# Altium project ANALOG.PrjPcb
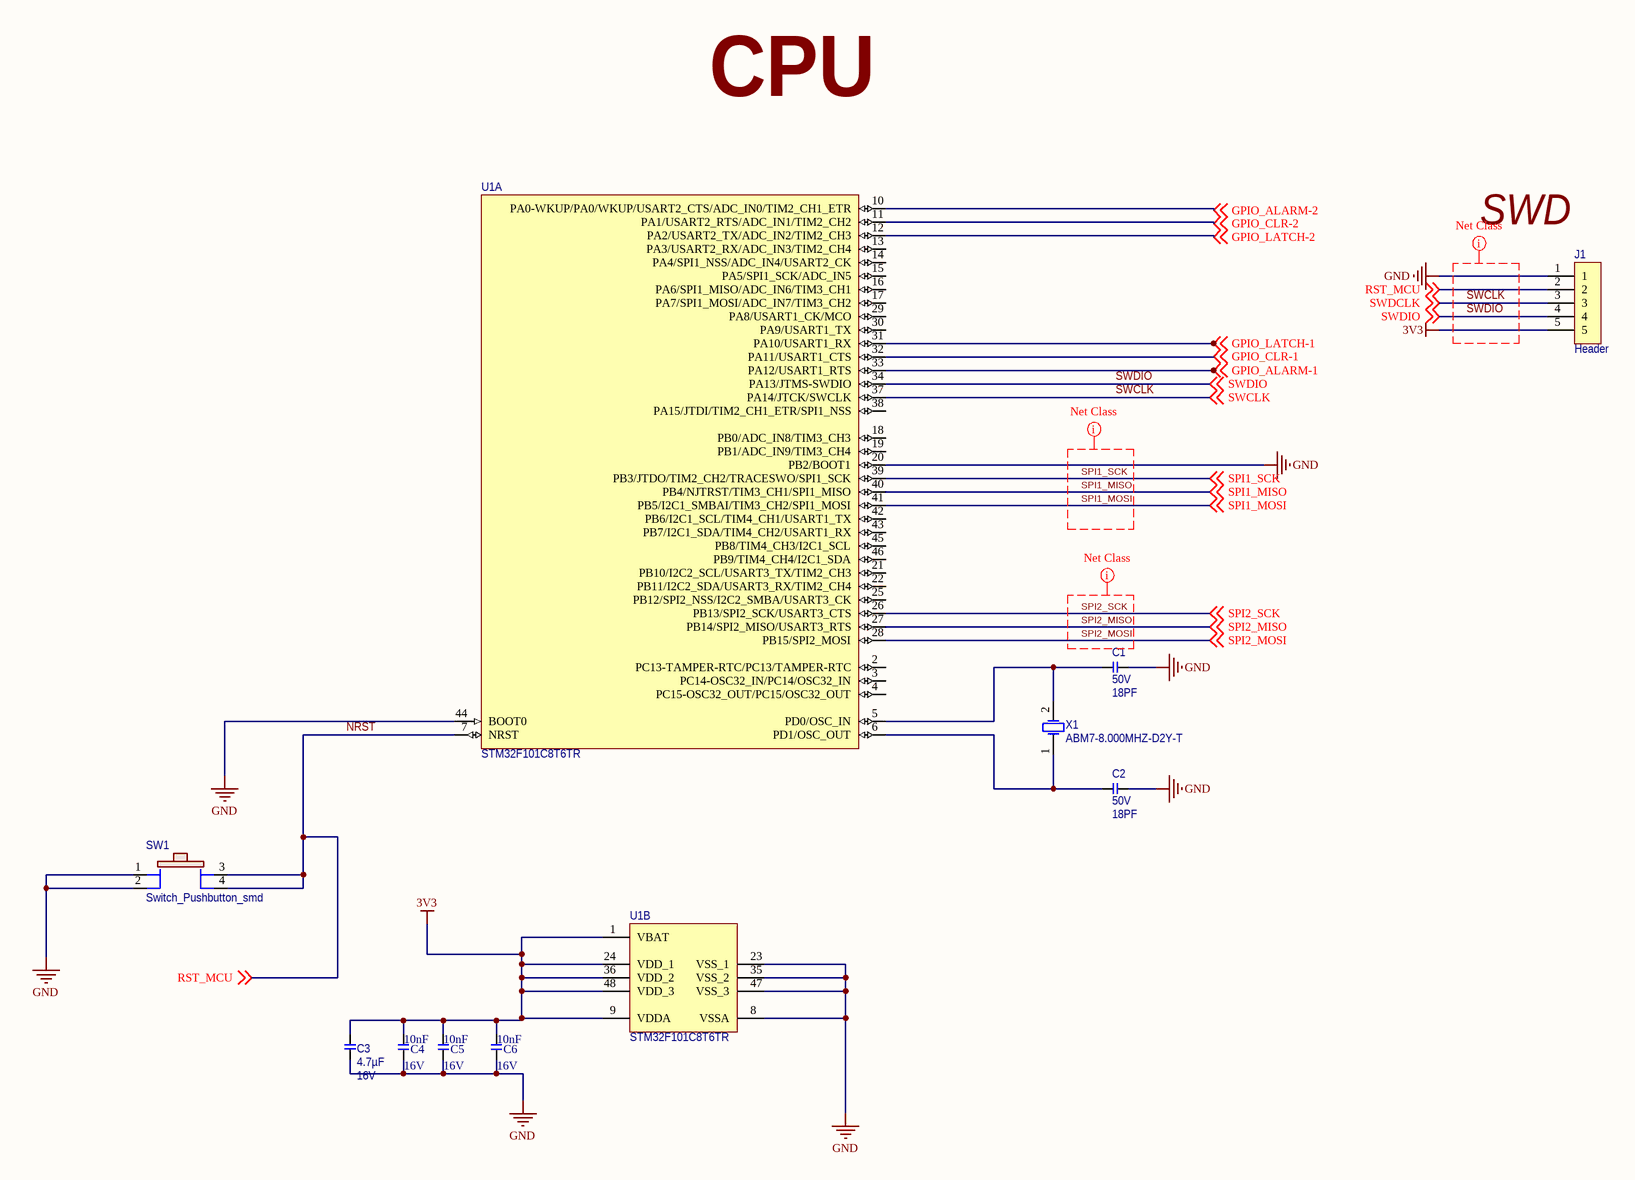
[diagram p0: [01] - STM32F101.SchDoc]
4 sheets, 83 parts. Net scope: global (net labels, ports and power ports of the same name join across sheets).
Board file: Analog_Modul.PcbDoc
Sheets:
  [01] - STM32F101.SchDoc
  [02] - AD7734.SchDoc
  [03] - DAC8760.SchDoc
  [04] - miniPCI.SchDoc

## Sheet [01] - STM32F101.SchDoc
size A3

### Parts
C1  voltage_rating_dc: 50V  [C0805]  (hidden comment: 18PF)
C2  voltage_rating_dc: 50V  [C0805]  (hidden comment: 18PF)
C3  Voltage - Rated: 16V  [C0805]  (hidden comment: 4.7µF)
C4  Voltage - Rated: 16V  [C0805]  (hidden comment: 10nF)
C5  Voltage - Rated: 16V  [C0805]  (hidden comment: 10nF)
C6  Voltage - Rated: 16V  [C0805]  (hidden comment: 10nF)
J1  Header  [Header 1x5 2.54mm]
SW1  Switch_Pushbutton_smd  [SW_B3SL-1022P]
U1  Manufacturer Part Number: STM32F101C8T6TR  [STM-LQFP48_M]  (hidden comment: IC-MC-STM32F101C8T6TR)  (parts A,B of 2)
X1  Manufacturer Part Number: ABM7-8.000MHZ-D2Y-T  [sm_osc_mixed]  (hidden comment: ABM7-8.000MHZ)

### Nets
3V3: C3.2 C4.2 C5.2 C6.2 J1.5 U1.1(VBAT) U1.9(VDDA) U1.24(VDD_1) U1.36(VDD_2) U1.48(VDD_3)
GND: C1.2 C2.2 C3.1 C4.1 C5.1 C6.1 J1.1 SW1.1 SW1.2 U1.8(VSSA) U1.20(PB2/BOOT1) U1.23(VSS_1) U1.35(VSS_2) U1.44(BOOT0) U1.47(VSS_3)
GPIO_ALARM-1: U1.33(PA12/USART1_RTS) ; off-sheet GPIO_ALARM-1  [project net ALARM-1]
GPIO_ALARM-2: U1.10(PA0-WKUP/PA0/WKUP/USART2_CTS/ADC_IN0/TIM2_CH1_ETR) ; off-sheet GPIO_ALARM-2  [project net ALARM-2]
GPIO_CLR-1: U1.32(PA11/USART1_CTS) ; off-sheet GPIO_CLR-1  [project net CLR-1]
GPIO_CLR-2: U1.11(PA1/USART2_RTS/ADC_IN1/TIM2_CH2) ; off-sheet GPIO_CLR-2  [project net CLR-2]
GPIO_LATCH-1: U1.31(PA10/USART1_RX) ; off-sheet GPIO_LATCH-1  [project net LATCH-1]
GPIO_LATCH-2: U1.12(PA2/USART2_TX/ADC_IN2/TIM2_CH3) ; off-sheet GPIO_LATCH-2  [project net LATCH-2]
NRST: J1.2 SW1.3 SW1.4 U1.7(NRST) ; off-sheet RST_MCU  [also labelled RST_MCU]
SPI1_MISO: U1.40(PB4/NJTRST/TIM3_CH1/SPI1_MISO) ; off-sheet SPI1_MISO
SPI1_MOSI: U1.41(PB5/I2C1_SMBAI/TIM3_CH2/SPI1_MOSI) ; off-sheet SPI1_MOSI
SPI1_SCK: U1.39(PB3/JTDO/TIM2_CH2/TRACESWO/SPI1_SCK) ; off-sheet SPI1_SCK
SPI2_MISO: U1.27(PB14/SPI2_MISO/USART3_RTS) ; off-sheet SPI2_MISO
SPI2_MOSI: U1.28(PB15/SPI2_MOSI) ; off-sheet SPI2_MOSI
SPI2_SCK: U1.26(PB13/SPI2_SCK/USART3_CTS) ; off-sheet SPI2_SCK
SWCLK: J1.3 U1.37(PA14/JTCK/SWCLK) ; off-sheet SWCLK, off-sheet SWDCLK  [also labelled SWDCLK]
SWDIO: J1.4 U1.34(PA13/JTMS-SWDIO) ; off-sheet SWDIO
NetC1_1: C1.1 U1.5(PD0/OSC_IN) X1.2(OSC2)
NetC2_1: C2.1 U1.6(PD1/OSC_OUT) X1.1(OSC1)

Not connected (* = marked no-connect by the designer): U1 2(PC13-TAMPER-RTC/PC13/TAMPER-RTC) 3(PC14-OSC32_IN/PC14/OSC32_IN) 4(PC15-OSC32_OUT/PC15/OSC32_OUT) 13(PA3/USART2_RX/ADC_IN3/TIM2_CH4) 14(PA4/SPI1_NSS/ADC_IN4/USART2_CK) 15(PA5/SPI1_SCK/ADC_IN5) 16(PA6/SPI1_MISO/ADC_IN6/TIM3_CH1) 17(PA7/SPI1_MOSI/ADC_IN7/TIM3_CH2) 18(PB0/ADC_IN8/TIM3_CH3) 19(PB1/ADC_IN9/TIM3_CH4) 21(PB10/I2C2_SCL/USART3_TX/TIM2_CH3) 22(PB11/I2C2_SDA/USART3_RX/TIM2_CH4) 25(PB12/SPI2_NSS/I2C2_SMBA/USART3_CK) 29(PA8/USART1_CK/MCO) 30(PA9/USART1_TX) 38(PA15/JTDI/TIM2_CH1_ETR/SPI1_NSS) 42(PB6/I2C1_SCL/TIM4_CH1/USART1_TX) 43(PB7/I2C1_SDA/TIM4_CH2/USART1_RX) 45(PB8/TIM4_CH3/I2C1_SCL) 46(PB9/TIM4_CH4/I2C1_SDA)

### Layout directives
net class SPI_1: SPI1_MISO, SPI1_MOSI, SPI1_SCK
net class SPI_2: SPI2_MISO, SPI2_MOSI, SPI2_SCK
net class SWD: SWCLK, SWDIO

### Notes on the sheet
- CPU
- (near J1) SWD

### Library data of the parts
C1 C2 = C-18PF,50V,0805: MULTICOMP - MC0805N180J500CT - CAP, MLCC, C0G/NP0, 18PF, 50V,0805, REEL; capacitance_tolerance: ±5%; pin_count: 2; Supplier 1: Octopart; Manufacturer: Multicomp; Manufacturer Part Number: MC0805N180J500CT; Stock 1: 3187; Pricing 1: 1=0.11400, 10=0.07300, 50=0.04100, 100=0.03200, 250=0.02600, 500=0.02200, 1000=0.01800 (USD); reach_svhc_compliance: No SVHC; rohs_status: Compliant; dielectric_characteristic: C0G/NP0; Octopart Url: http://octopart.com/mc0805n180j500ct-multicomp-10529169; Seller Landing  Url: https://octopart-clicks.com/click/track?country=TR&ak=8157f166&sig=03c9fd1&sid=2402&ppid=10529169&vpid=17760821&ct=offers; OctopartID: 811748bd0de05ed0; ComponentLink1URL: http://datasheet.octopart.com/MC0805N180J500CT-Multicomp-datasheet-16478625.pdf; ComponentLink1Description: http://datasheet.octopart.com/MC0805N180J500CT-Multicomp-datasheet-16478625.pdf; ComponentLink2URL: http://datasheet.octopart.com/MC0805N180J500CT-Multicomp-datasheet-22150886.pdf; ComponentLink2Description: http://datasheet.octopart.com/MC0805N180J500CT-Multicomp-datasheet-22150886.pdf; ComponentLink3URL: http://datasheet.octopart.com/MC0805N180J500CT-Multicomp-datasheet-8445804.pdf; ComponentLink3Description: http://datasheet.octopart.com/MC0805N180J500CT-Multicomp-datasheet-8445804.pdf; ComponentLink4URL: http://datasheet.octopart.com/MC0805N180J500CT-Multicomp-datasheet-34215986.pdf; ComponentLink4Description: http://datasheet.octopart.com/MC0805N180J500CT-Multicomp-datasheet-34215986.pdf; ComponentLink5URL: http://datasheet.octopart.com/MC0805N180J500CT-Multicomp-datasheet-26590290.pdf; ComponentLink5Description: http://datasheet.octopart.com/MC0805N180J500CT-Multicomp-datasheet-26590290.pdf; ComponentLink6URL: http://datasheet.octopart.com/MC0805N180J500CT-Multicomp-datasheet-15500401.pdf; ComponentLink6Description: http://datasheet.octopart.com/MC0805N180J500CT-Multicomp-datasheet-15500401.pdf; ComponentLink7URL: http://datasheet.octopart.com/MC0805N180J500CT-Multicomp-datasheet-10838970.pdf; ComponentLink7Description: http://datasheet.octopart.com/MC0805N180J500CT-Multicomp-datasheet-10838970.pdf; Supplier Part Number 1: Newark - 06R4039; capacitance: 18PF
C3 = C-4.7UF,16V,0805: AVX - 0805YC475KAT2A - CAP, MLCC, X7R, 4.7UF, 16V, 0805; Manufacturer: AVX Corporation; Tolerance: ±10%; Supplier 1: Digi-Key; Manufacturer Part Number: 0805YC475KAT2A; RoHS: RoHS Compliant; Category: Capacitors; Stock 1: 16611; Pricing 1: 1=0.78, 10=0.578, 25=0.4952, 50=0.462, 100=0.396, 250=0.363, 500=0.3135, 1000=0.264 (USD); Packaging: Cut Tape (CT); Temperature Coefficient: X7R; Mounting Type: Surface Mount, MLCC; Operating Temperature: -55°C ~ 125°C; Applications: General Purpose; Ratings: -; Package / Case: 0805 (2012 Metric); Size / Dimension: 0.079" L x 0.049" W (2.01mm x 1.25mm); Height - Seated (Max): -; Thickness (Max): 0.060" (1.52mm); Lead Spacing: -; Features: -; Lead Style: -; ComponentLink1URL: http://datasheets.avx.com/X7RDielectric.pdf; ComponentLink1Description: http://datasheets.avx.com/X7RDielectric.pdf; Supplier Part Number 1: 478-5722-1-ND; Capacitance: 4.7µF
C4-C6 = C-10NF,0805: CAP CER 10000PF 16V NP0 0805; Manufacturer: AVX Corporation; Manufacturer Part Number: 0805YA103JAT2A; Tolerance: ±5%; Temperature Coefficient: C0G, NP0; Supplier 1: Digi-Key; RoHS: RoHS Compliant; Category: Capacitors; Stock 1: 28062; Pricing 1: 1=0.29, 10=0.204, 25=0.1668, 50=0.1424, 100=0.1221, 250=0.10176, 500=0.09158, 1000=0.07733 (USD); Packaging: Cut Tape (CT); Mounting Type: Surface Mount, MLCC; Operating Temperature: -55°C ~ 125°C; Applications: General Purpose; Ratings: -; Package / Case: 0805 (2012 Metric); Size / Dimension: 0.079" L x 0.049" W (2.01mm x 1.25mm); Height - Seated (Max): -; Thickness (Max): 0.037" (0.94mm); Lead Spacing: -; Features: -; Lead Style: -; ComponentLink1URL: http://datasheets.avx.com/C0GNP0-Dielectric.pdf; ComponentLink1Description: http://datasheets.avx.com/C0GNP0-Dielectric.pdf; Supplier Part Number 1: 478-1334-1-ND; Capacitance: 10nF
J1 = CON-Header 1X5 2.54MM: Header 1X5 2.54
SW1 = Switch_Pushbutton_smd: Switch Push Button tactile; TIIntPartnumber: 2W0018; MfrNum: B3SL-1022P; Mfr: Omron; PartName: SwitchPushMomTactilesmd; Cost10K: 0.25; Cost100: 0.340; Vendor: Digikey; DescriptiveText: Switch Push Button tactile; Descriptive_Text: Switch Push Button tactile
U1 = IC-MC-STM32F101C8T6TR: IC MCU 32BIT 64KB FLASH 48LQFP; Manufacturer: STMicroelectronics; Core Processor: ARM® Cortex®-M3; Core Size: 32-Bit; Speed: 36MHz; Connectivity: I²C, IrDA, LIN, SPI, UART/USART; Peripherals: DMA, PDR, POR, PVD, PWM, Temp Sensor, WDT; Number of I/O: 37; Program Memory Size: 64KB (64K x 8); RAM Size: 10K x 8; Voltage - Supply (Vcc/Vdd): 2 V ~ 3.6 V; Data Converters: A/D 10x12b; Oscillator Type: Internal; Supplier 1: Digi-Key; RoHS: RoHS Compliant; Category: Integrated Circuits (ICs); Stock 1: 0; Pricing 1: 2400=2.46449 (USD); Packaging: Tape & Reel (TR); Program Memory Type: FLASH; EEPROM Size: -; Operating Temperature: -40°C ~ 85°C (TA); Package / Case: 48-LQFP; Supplier Device Package: 48-LQFP (7x7); ComponentLink1URL: http://www.st.com/content/ccc/resource/technical/document/datasheet/6b/28/4e/ce/a7/d3/42/8d/CD00161561.pdf/files/CD00161561.pdf/jcr:content/translations/en.CD00161561.pdf; ComponentLink1Description: http://www.st.com/content/ccc/resource/technical/document/datasheet/6b/28/4e/ce/a7/d3/42/8d/CD00161561.pdf/files/CD00161561.pdf/jcr:content/translations/en.CD00161561.pdf; Supplier Part Number 1: STM32F101C8T6TR-ND
X1 = OSC-ABM7-8.000MHZ-D2Y-T: CRYSTAL 8.0000MHZ 18PF SMD; Manufacturer: Abracon LLC; Frequency: 8MHz; Frequency Stability: ±30ppm; Frequency Tolerance: ±20ppm; ESR (Equivalent Series Resistance): 100 Ohm; Operating Mode: Fundamental; Supplier 1: Digi-Key; RoHS: RoHS Compliant; Category: Crystals and Oscillators; Stock 1: 111842; Pricing 1: 1=0.76, 10=0.678, 50=0.6328, 100=0.56, 500=0.5292 (USD); Packaging: Cut Tape (CT); Type: MHz Crystal; Load Capacitance: 18pF; Operating Temperature: -40°C ~ 85°C; Ratings: -; Mounting Type: Surface Mount; Package / Case: 2-SMD, No Lead (DFN, LCC); Size / Dimension: 0.236" L x 0.138" W (6.00mm x 3.50mm); Height: 0.055" (1.40mm); ComponentLink1URL: http://www.abracon.com/Resonators/abm7.pdf; ComponentLink1Description: http://www.abracon.com/Resonators/abm7.pdf; Supplier Part Number 1: 535-9831-1-ND

## Sheet [02] - AD7734.SchDoc
size A3
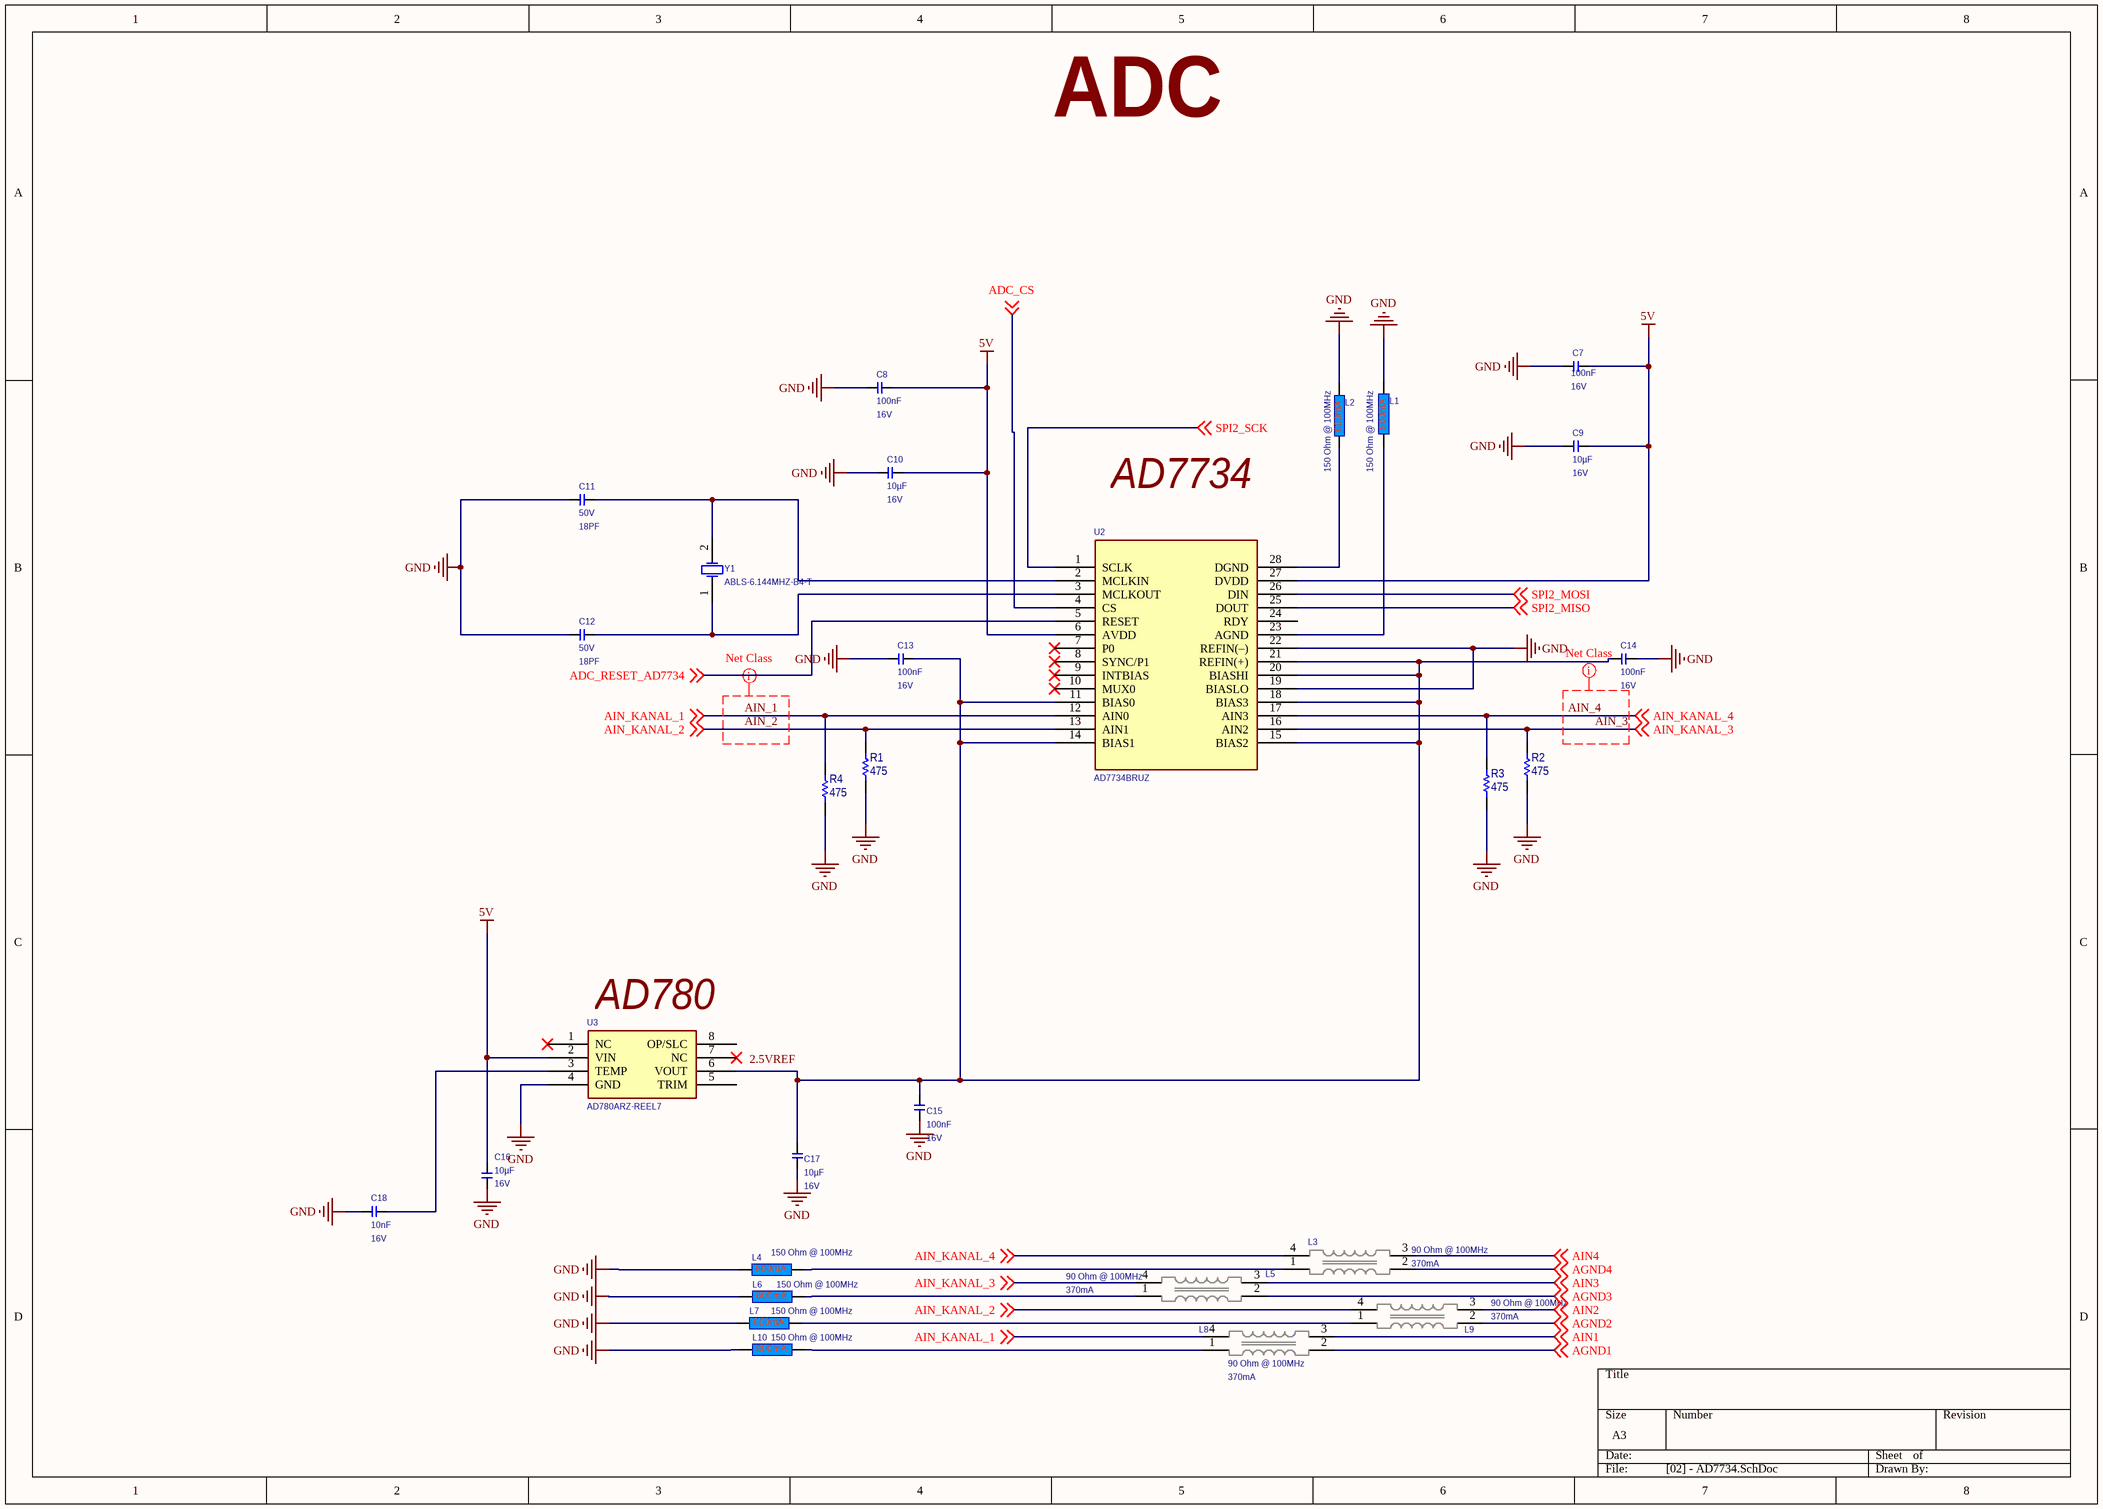
[diagram p1: [02] - AD7734.SchDoc]

### Parts
C7  Voltage - Rated: 16V  [C0805]  (hidden comment: 100nF)
C8  Voltage - Rated: 16V  [C0805]  (hidden comment: 100nF)
C9  Voltage - Rated: 16V  [C0805]  (hidden comment: 10µF)
C10  Voltage - Rated: 16V  [C0805]  (hidden comment: 10µF)
C11  voltage_rating_dc: 50V  [C0805]  (hidden comment: 18PF)
C12  voltage_rating_dc: 50V  [C0805]  (hidden comment: 18PF)
C13  Voltage - Rated: 16V  [C0805]  (hidden comment: 100nF)
C14  Voltage - Rated: 16V  [C0805]  (hidden comment: 100nF)
C15  Voltage - Rated: 16V  [C0805]  (hidden comment: 100nF)
C16  Voltage - Rated: 16V  [C0805]  (hidden comment: 10µF)
C17  Voltage - Rated: 16V  [C0805]  (hidden comment: 10µF)
C18  Voltage - Rated: 16V  [C0805]  (hidden comment: 10nF)
L1  150 Ohm @ 100MHz  [0805]
L2  150 Ohm @ 100MHz  [0805]
L3  Current Rating (Max): 370mA  [FILTER]  (hidden comment: 90 Ohm @ 100MHz)
L4  150 Ohm @ 100MHz  [0805]
L5  Current Rating (Max): 370mA  [FILTER]  (hidden comment: 90 Ohm @ 100MHz)
L6  150 Ohm @ 100MHz  [0805]
L7  150 Ohm @ 100MHz  [0805]
L8  Current Rating (Max): 370mA  [FILTER]  (hidden comment: 90 Ohm @ 100MHz)
L9  Current Rating (Max): 370mA  [FILTER]  (hidden comment: 90 Ohm @ 100MHz)
L10  150 Ohm @ 100MHz  [0805]
R1  Resistance (Ohms): 475  [R1206]  (hidden comment: RES SMD 475 OHM 1206)
R2  Resistance (Ohms): 475  [R1206]  (hidden comment: RES SMD 475 OHM 1206)
R3  Resistance (Ohms): 475  [R1206]  (hidden comment: RES SMD 475 OHM 1206)
R4  Resistance (Ohms): 475  [R1206]  (hidden comment: RES SMD 475 OHM 1206)
U2  AD7734BRUZ  [TSSOP-28]
U3  Manufacturer Part Number: AD780ARZ-REEL7  [SOIC-8]  (hidden comment: AD780ARZ)
Y1  Manufacturer Part Number: ABLS-6.144MHZ-B4-T  [HEADER,2PİN ADC]  (hidden comment: ABLS-6.144MHZ)

### Nets
5V: C7.2 C8.2 C9.2 C10.2 C16.2 U2.6(AVDD) U2.27(DVDD) U3.2(VIN)
GND: C7.1 C8.1 C9.1 C10.1 C11.1 C12.1 C13.1 C14.2 C15.2 C16.1 C17.1 C18.1 L1.2 L2.2 L4.1 L6.1 L7.1 L10.1 R1.1 R2.1 R3.1 R4.1 U2.19(BIASLO) U2.22(REFIN(–)) U3.4(GND)
ADC_CS: U2.4(CS) ; off-sheet ADC_CS
ADC_RESET_AD7734: U2.5(RESET) ; off-sheet ADC_RESET_AD7734
AGND1: L8.2 ; off-sheet AGND1
AGND2: L9.2 ; off-sheet AGND2
AGND3: L5.2 ; off-sheet AGND3
AGND4: L3.2 ; off-sheet AGND4
AIN1: L8.3 ; off-sheet AIN1
AIN2: L9.3 ; off-sheet AIN2
AIN3: L5.3 ; off-sheet AIN3
AIN4: L3.3 ; off-sheet AIN4
AIN_1: L8.4 R4.2 U2.12(AIN0) ; off-sheet AIN_KANAL_1  [also labelled AIN_KANAL_1]
AIN_2: L9.4 R1.2 U2.13(AIN1) ; off-sheet AIN_KANAL_2  [also labelled AIN_KANAL_2]
AIN_3: L5.4 R2.2 U2.16(AIN2) ; off-sheet AIN_KANAL_3  [also labelled AIN_KANAL_3]
AIN_4: L3.4 R3.2 U2.17(AIN3) ; off-sheet AIN_KANAL_4  [also labelled AIN_KANAL_4]
SPI2_MISO: U2.25(DOUT) ; off-sheet SPI2_MISO
SPI2_MOSI: U2.26(DIN) ; off-sheet SPI2_MOSI
SPI2_SCK: U2.1(SCLK) ; off-sheet SPI2_SCK
NetC11_2: C11.2 U2.2(MCLKIN) Y1.2(OSC2)
NetC12_2: C12.2 U2.3(MCLKOUT) Y1.1(OSC1)
NetC13_2: C13.2 C14.1 C15.1 C17.2 U2.11(BIAS0) U2.14(BIAS1) U2.15(BIAS2) U2.18(BIAS3) U2.20(BIASHI) U2.21(REFIN(+)) U3.6(VOUT)
NetC18_2: C18.2 U3.3(TEMP)
NetL1_1: L1.1 U2.23(AGND)
NetL2_1: L2.1 U2.28(DGND)
NetL3_1: L3.1 L4.2
NetL5_1: L5.1 L6.2
NetL7_2: L7.2 L9.1
NetL8_1: L8.1 L10.2

Not connected (* = marked no-connect by the designer): U2 7(P0)* 8(SYNC/P1)* 9(INTBIAS)* 10(MUX0)* 24(RDY); U3 1(NC)* 5(TRIM) 7(NC)* 8(OP/SLC)

### Layout directives
net class ADC_IN: AIN_1, AIN_2, AIN_3, AIN_4

### Notes on the sheet
- ADC
- AD7734
- (near U3) AD780
- Labels drawn without touching a wire or pin: 2.5VREF

### Library data of the parts
C7 C8 C13-C15 = C-100NF,16V,0805: AVX - 0805YA103JAT2A - CAP, MLCC, C0G/NP0, 10NF, 16V, 0805; Tolerance: ±5%; Temperature Coefficient: C0G, NP0; Manufacturer: AVX; Manufacturer Part Number: 0805YA103JAT2A; RoHS: YES; ComponentLink1URL: http://www.avx.com/docs/Catalogs/ccog.pdf; ComponentLink1Description: http://www.avx.com/docs/Catalogs/ccog.pdf; ComponentLink2URL: http://www.farnell.com/datasheets/1825494.pdf; ComponentLink2Description: http://www.farnell.com/datasheets/1825494.pdf; Supplier 1: Digi-Key; Category: Capacitors; Stock 1: 28062; Pricing 1: 1=0.29, 10=0.204, 25=0.1668, 50=0.1424, 100=0.1221, 250=0.10176, 500=0.09158, 1000=0.07733 (USD); Packaging: Cut Tape (CT); Mounting Type: Surface Mount, MLCC; Operating Temperature: -55°C ~ 125°C; Applications: General Purpose; Ratings: -; Package / Case: 0805 (2012 Metric); Size / Dimension: 0.079" L x 0.049" W (2.01mm x 1.25mm); Height - Seated (Max): -; Thickness (Max): 0.037" (0.94mm); Lead Spacing: -; Features: -; Lead Style: -; ComponentLink3URL: http://datasheets.avx.com/C0GNP0-Dielectric.pdf; ComponentLink3Description: http://datasheets.avx.com/C0GNP0-Dielectric.pdf; Supplier Part Number 1: 478-1334-1-ND; Capacitance: 100nF
C9 C10 C16 C17 = C-10UF,16V,0805: AVX - 0805YD106KAT2A - CAP, MLCC, X5R, 10UF, 16V, 0805; Manufacturer: AVX Corporation; Tolerance: ±10%; Supplier 1: Digi-Key; Manufacturer Part Number: 0805YD106KAT2A; RoHS: RoHS Compliant; Category: Capacitors; Stock 1: 293738; Pricing 1: 1=0.18, 10=0.124, 25=0.0908, 50=0.0742, 100=0.0627, 250=0.05116, 500=0.0429, 1000=0.03795 (USD); Packaging: Digi-Reel®; Temperature Coefficient: X5R; Mounting Type: Surface Mount, MLCC; Operating Temperature: -55°C ~ 85°C; Applications: General Purpose; Ratings: -; Package / Case: 0805 (2012 Metric); Size / Dimension: 0.079" L x 0.049" W (2.01mm x 1.25mm); Height - Seated (Max): -; Thickness (Max): 0.055" (1.40mm); Lead Spacing: -; Features: -; Lead Style: -; ComponentLink1URL: http://datasheets.avx.com/cx5r.pdf; ComponentLink1Description: http://datasheets.avx.com/cx5r.pdf; Supplier Part Number 1: 478-5165-6-ND; Capacitance: 10µF
C11 C12 = C-18PF,50V,0805: as C1 on sheet [01] - STM32F101; Supplier 1: Octopart; Manufacturer: Multicomp; Manufacturer Part Number: MC0805N180J500CT; Stock 1: 3187; Pricing 1: 1=0.11400, 10=0.07300, 50=0.04100, 100=0.03200, 250=0.02600, 500=0.02200, 1000=0.01800 (USD); reach_svhc_compliance: No SVHC; rohs_status: Compliant; dielectric_characteristic: C0G/NP0; Octopart Url: http://octopart.com/mc0805n180j500ct-multicomp-10529169; Seller Landing  Url: https://octopart-clicks.com/click/track?country=TR&ak=8157f166&sig=03c9fd1&sid=2402&ppid=10529169&vpid=17760821&ct=offers; OctopartID: 811748bd0de05ed0; ComponentLink1URL: http://datasheet.octopart.com/MC0805N180J500CT-Multicomp-datasheet-16478625.pdf; ComponentLink1Description: http://datasheet.octopart.com/MC0805N180J500CT-Multicomp-datasheet-16478625.pdf; ComponentLink2URL: http://datasheet.octopart.com/MC0805N180J500CT-Multicomp-datasheet-22150886.pdf; ComponentLink2Description: http://datasheet.octopart.com/MC0805N180J500CT-Multicomp-datasheet-22150886.pdf; ComponentLink3URL: http://datasheet.octopart.com/MC0805N180J500CT-Multicomp-datasheet-8445804.pdf; ComponentLink3Description: http://datasheet.octopart.com/MC0805N180J500CT-Multicomp-datasheet-8445804.pdf; ComponentLink4URL: http://datasheet.octopart.com/MC0805N180J500CT-Multicomp-datasheet-34215986.pdf; ComponentLink4Description: http://datasheet.octopart.com/MC0805N180J500CT-Multicomp-datasheet-34215986.pdf; ComponentLink5URL: http://datasheet.octopart.com/MC0805N180J500CT-Multicomp-datasheet-26590290.pdf; ComponentLink5Description: http://datasheet.octopart.com/MC0805N180J500CT-Multicomp-datasheet-26590290.pdf; ComponentLink6URL: http://datasheet.octopart.com/MC0805N180J500CT-Multicomp-datasheet-15500401.pdf; ComponentLink6Description: http://datasheet.octopart.com/MC0805N180J500CT-Multicomp-datasheet-15500401.pdf; ComponentLink7URL: http://datasheet.octopart.com/MC0805N180J500CT-Multicomp-datasheet-10838970.pdf; ComponentLink7Description: http://datasheet.octopart.com/MC0805N180J500CT-Multicomp-datasheet-10838970.pdf; Supplier Part Number 1: Newark - 06R4039; capacitance: 18PF
C18 = C-10NF,0805: as C4 on sheet [01] - STM32F101; Supplier 1: Digi-Key; RoHS: RoHS Compliant; Category: Capacitors; Stock 1: 28062; Pricing 1: 1=0.29, 10=0.204, 25=0.1668, 50=0.1424, 100=0.1221, 250=0.10176, 500=0.09158, 1000=0.07733 (USD); Packaging: Cut Tape (CT); Mounting Type: Surface Mount, MLCC; Operating Temperature: -55°C ~ 125°C; Applications: General Purpose; Ratings: -; Package / Case: 0805 (2012 Metric); Size / Dimension: 0.079" L x 0.049" W (2.01mm x 1.25mm); Height - Seated (Max): -; Thickness (Max): 0.037" (0.94mm); Lead Spacing: -; Features: -; Lead Style: -; ComponentLink1URL: http://datasheets.avx.com/C0GNP0-Dielectric.pdf; ComponentLink1Description: http://datasheets.avx.com/C0GNP0-Dielectric.pdf; Supplier Part Number 1: 478-1334-1-ND; Capacitance: 10nF
L1 L2 L4 L6 L7 L10 = L-150OHM,800MA: FERRITE 800MA 150 OHM 0805 SMD; Manufacturer: Laird-Signal Integrity Products; Manufacturer Part Number: LI0805H151R-10; DC Resistance (DCR): 150 mOhm Max; Filter Type: Differential Mode - Single; Supplier 1: Digi-Key; RoHS: RoHS Compliant; Category: Filters; Stock 1: 418596; Pricing 1: 1=0.1, 10=0.07, 25=0.064, 50=0.0574, 100=0.0421, 250=0.03064, 500=0.02808, 1000=0.02424 (USD); Packaging: Cut Tape (CT); Current Rating: 800mA; Package / Case: 0805 (2012 Metric); Mounting Type: Surface Mount; Height (Max): 0.043" (1.10mm); Size / Dimension: 0.079" L x 0.049" W (2.00mm x 1.25mm); ComponentLink1URL: http://www.lairdtech.com/WorkArea/linkit.aspx?LinkIdentifier=id&ItemID=4912; ComponentLink1Description: http://www.lairdtech.com/WorkArea/linkit.aspx?LinkIdentifier=id&ItemID=4912; Supplier Part Number 1: 240-2384-1-ND; Impedance @ Frequency: 150 Ohm @ 100MHz
L3 L5 L8 L9 = L-CMC 90 OHM 370MA 2 LN SMD: CMC 90 OHM 370MA 2 LN SMD; Manufacturer: Abracon LLC; Manufacturer Part Number: ACM-31-900M-T; Filter Type: Signal Line; Number of Lines: 2; DC Resistance (DCR) (Max): 300 mOhm; Voltage Rating - DC: 50V; Supplier 1: Digi-Key; RoHS: RoHS Compliant; Category: Filters; Stock 1: 3796; Pricing 1: 1=0.5, 10=0.44, 25=0.4124, 50=0.3576, 100=0.33, 250=0.31352, 500=0.286, 1000=0.242 (USD); Packaging: Cut Tape (CT); Inductance @ Frequency: -; Voltage Rating - AC: -; Operating Temperature: -40°C ~ 85°C; Ratings: -; Approvals: -; Features: -; Mounting Type: Surface Mount; Size / Dimension: 0.118" L x 0.063" W (3.00mm x 1.60mm); Height (Max): 0.079" (2.00mm); Package / Case: Horizontal, 4 PC Pad; ComponentLink1URL: http://www.abracon.com/Magnetics/chokes/ACM-31.pdf; ComponentLink1Description: http://www.abracon.com/Magnetics/chokes/ACM-31.pdf; Supplier Part Number 1: 535-12752-1-ND; Impedance @ Frequency: 90 Ohm @ 100MHz
R1-R4 = R-475R,1206: RES SMD 475 OHM 1% 1/2W 1206; Manufacturer: Stackpole Electronics Inc.; Manufacturer Part Number: RNCP1206FTD475R; Power (Watts): 0.5W, 1/2W; Temperature Coefficient: ±100ppm/°C; Supplier 1: Digi-Key; RoHS: RoHS Compliant; Category: Resistors; Stock 1: 673911; Pricing 1: 1=0.1, 10=0.049, 50=0.0272, 100=0.0201, 250=0.01536, 500=0.01228, 1000=0.00904, 2500=0.00784 (USD); Packaging: Cut Tape (CT); Part Status: Active; Tolerance: ±1%; Composition: Thin Film; Features: Anti-Sulfur, Moisture Resistant; Operating Temperature: -55°C ~ 155°C; Package / Case: 1206 (3216 Metric); Supplier Device Package: 1206; Size / Dimension: 0.122" L x 0.059" W (3.10mm x 1.50mm); Height: 0.024" (0.60mm); Number of Terminations: 2; Failure Rate: -; ComponentLink1URL: http://www.seielect.com/catalog/SEI-RNCP.pdf; ComponentLink1Description: http://www.seielect.com/catalog/SEI-RNCP.pdf; Supplier Part Number 1: RNCP1206FTD475RCT-ND
U2 = IC-AD7734BRUZ: IC ADC 24BIT 4-CH 28-TSSOP; Manufacturer: Analog Devices Inc.; Number of Bits: 24; Sampling Rate (Per Second): 15.4k; Number of Inputs: 4; Input Type: Single Ended; Data Interface: SPI, DSP; Configuration: MUX-ADC; Number of A/D Converters: 1; Architecture: Sigma-Delta; Reference Type: External; Voltage - Supply, Analog: 5V; Voltage - Supply, Digital: 2.7 V ~ 3.6 V, 5V; Supplier 1: Digi-Key; RoHS: RoHS Compliant; Category: Integrated Circuits (ICs); Stock 1: 383; Pricing 1: 1=20.47, 10=18.882, 100=16.1242, 500=14.63904, 1000=13.7904, 2500=13.36608, 5000=13.056 (USD); Packaging: Tube; Ratio - S/H:ADC: -; Features: True Bipolar; Operating Temperature: -40°C ~ 105°C; Package / Case: 28-TSSOP (0.173", 4.40mm Width); Supplier Device Package: 28-TSSOP; ComponentLink1URL: http://www.analog.com/media/en/technical-documentation/data-sheets/AD7734.pdf; ComponentLink1Description: http://www.analog.com/media/en/technical-documentation/data-sheets/AD7734.pdf; Supplier Part Number 1: AD7734BRUZ-ND; Manufacturer Part Number: AD7734BRUZ
U3 = IC-AD780ARZ: IC VREF SERIES/SHUNT PROG 8SOIC; Manufacturer: Analog Devices Inc.; Reference Type: Series, Shunt; Output Type: Programmable; Voltage - Output (Min/Fixed): ±2.5V, ±3V; Current - Output: 10mA; Tolerance: ±0.2%, ±0.17%; Temperature Coefficient: 7ppm/°C; Noise - 0.1Hz to 10Hz: 4µVp-p; Voltage - Input: 4 V ~ 36 V; Current - Supply: 1mA; Supplier 1: Digi-Key; RoHS: RoHS Compliant; Category: Integrated Circuits (ICs); Stock 1: 1014; Pricing 1: 1=10.53, 10=9.545, 100=7.8685, 500=6.8796 (USD); Packaging: Cut Tape (CT); Voltage - Output (Max): -; Noise - 10Hz to 10kHz: -; Current - Cathode: 1mA; Operating Temperature: -40°C ~ 85°C (TA); Mounting Type: Surface Mount; Package / Case: 8-SOIC (0.154", 3.90mm Width); Supplier Device Package: 8-SOIC; ComponentLink1URL: http://www.analog.com/media/en/technical-documentation/data-sheets/AD780.pdf; ComponentLink1Description: http://www.analog.com/media/en/technical-documentation/data-sheets/AD780.pdf; Supplier Part Number 1: AD780ARZ-REEL7CT-ND
Y1 = OSC-ABLS-6.144MHZ-B4-T: CRYSTAL 6.1440MHZ 18PF SMD; Manufacturer: Abracon LLC; Frequency Stability: ±50ppm; Frequency Tolerance: ±30ppm; ESR (Equivalent Series Resistance): 100 Ohm; Operating Mode: Fundamental; Supplier 1: Digi-Key; RoHS: RoHS Compliant; Category: Crystals and Oscillators; Stock 1: 3930; Pricing 1: 1=0.35, 10=0.289, 50=0.2596, 100=0.231, 500=0.22 (USD); Packaging: Cut Tape (CT); Type: MHz Crystal; Frequency: 6.144MHz; Load Capacitance: 18pF; Operating Temperature: -20°C ~ 70°C; Ratings: -; Mounting Type: Surface Mount; Package / Case: HC49/US; Size / Dimension: 0.449" L x 0.185" W (11.40mm x 4.70mm); Height: 0.165" (4.20mm); ComponentLink1URL: http://www.abracon.com/Resonators/abls.pdf; ComponentLink1Description: http://www.abracon.com/Resonators/abls.pdf; Supplier Part Number 1: 535-10209-1-ND

## Sheet [03] - DAC8760.SchDoc
size A2
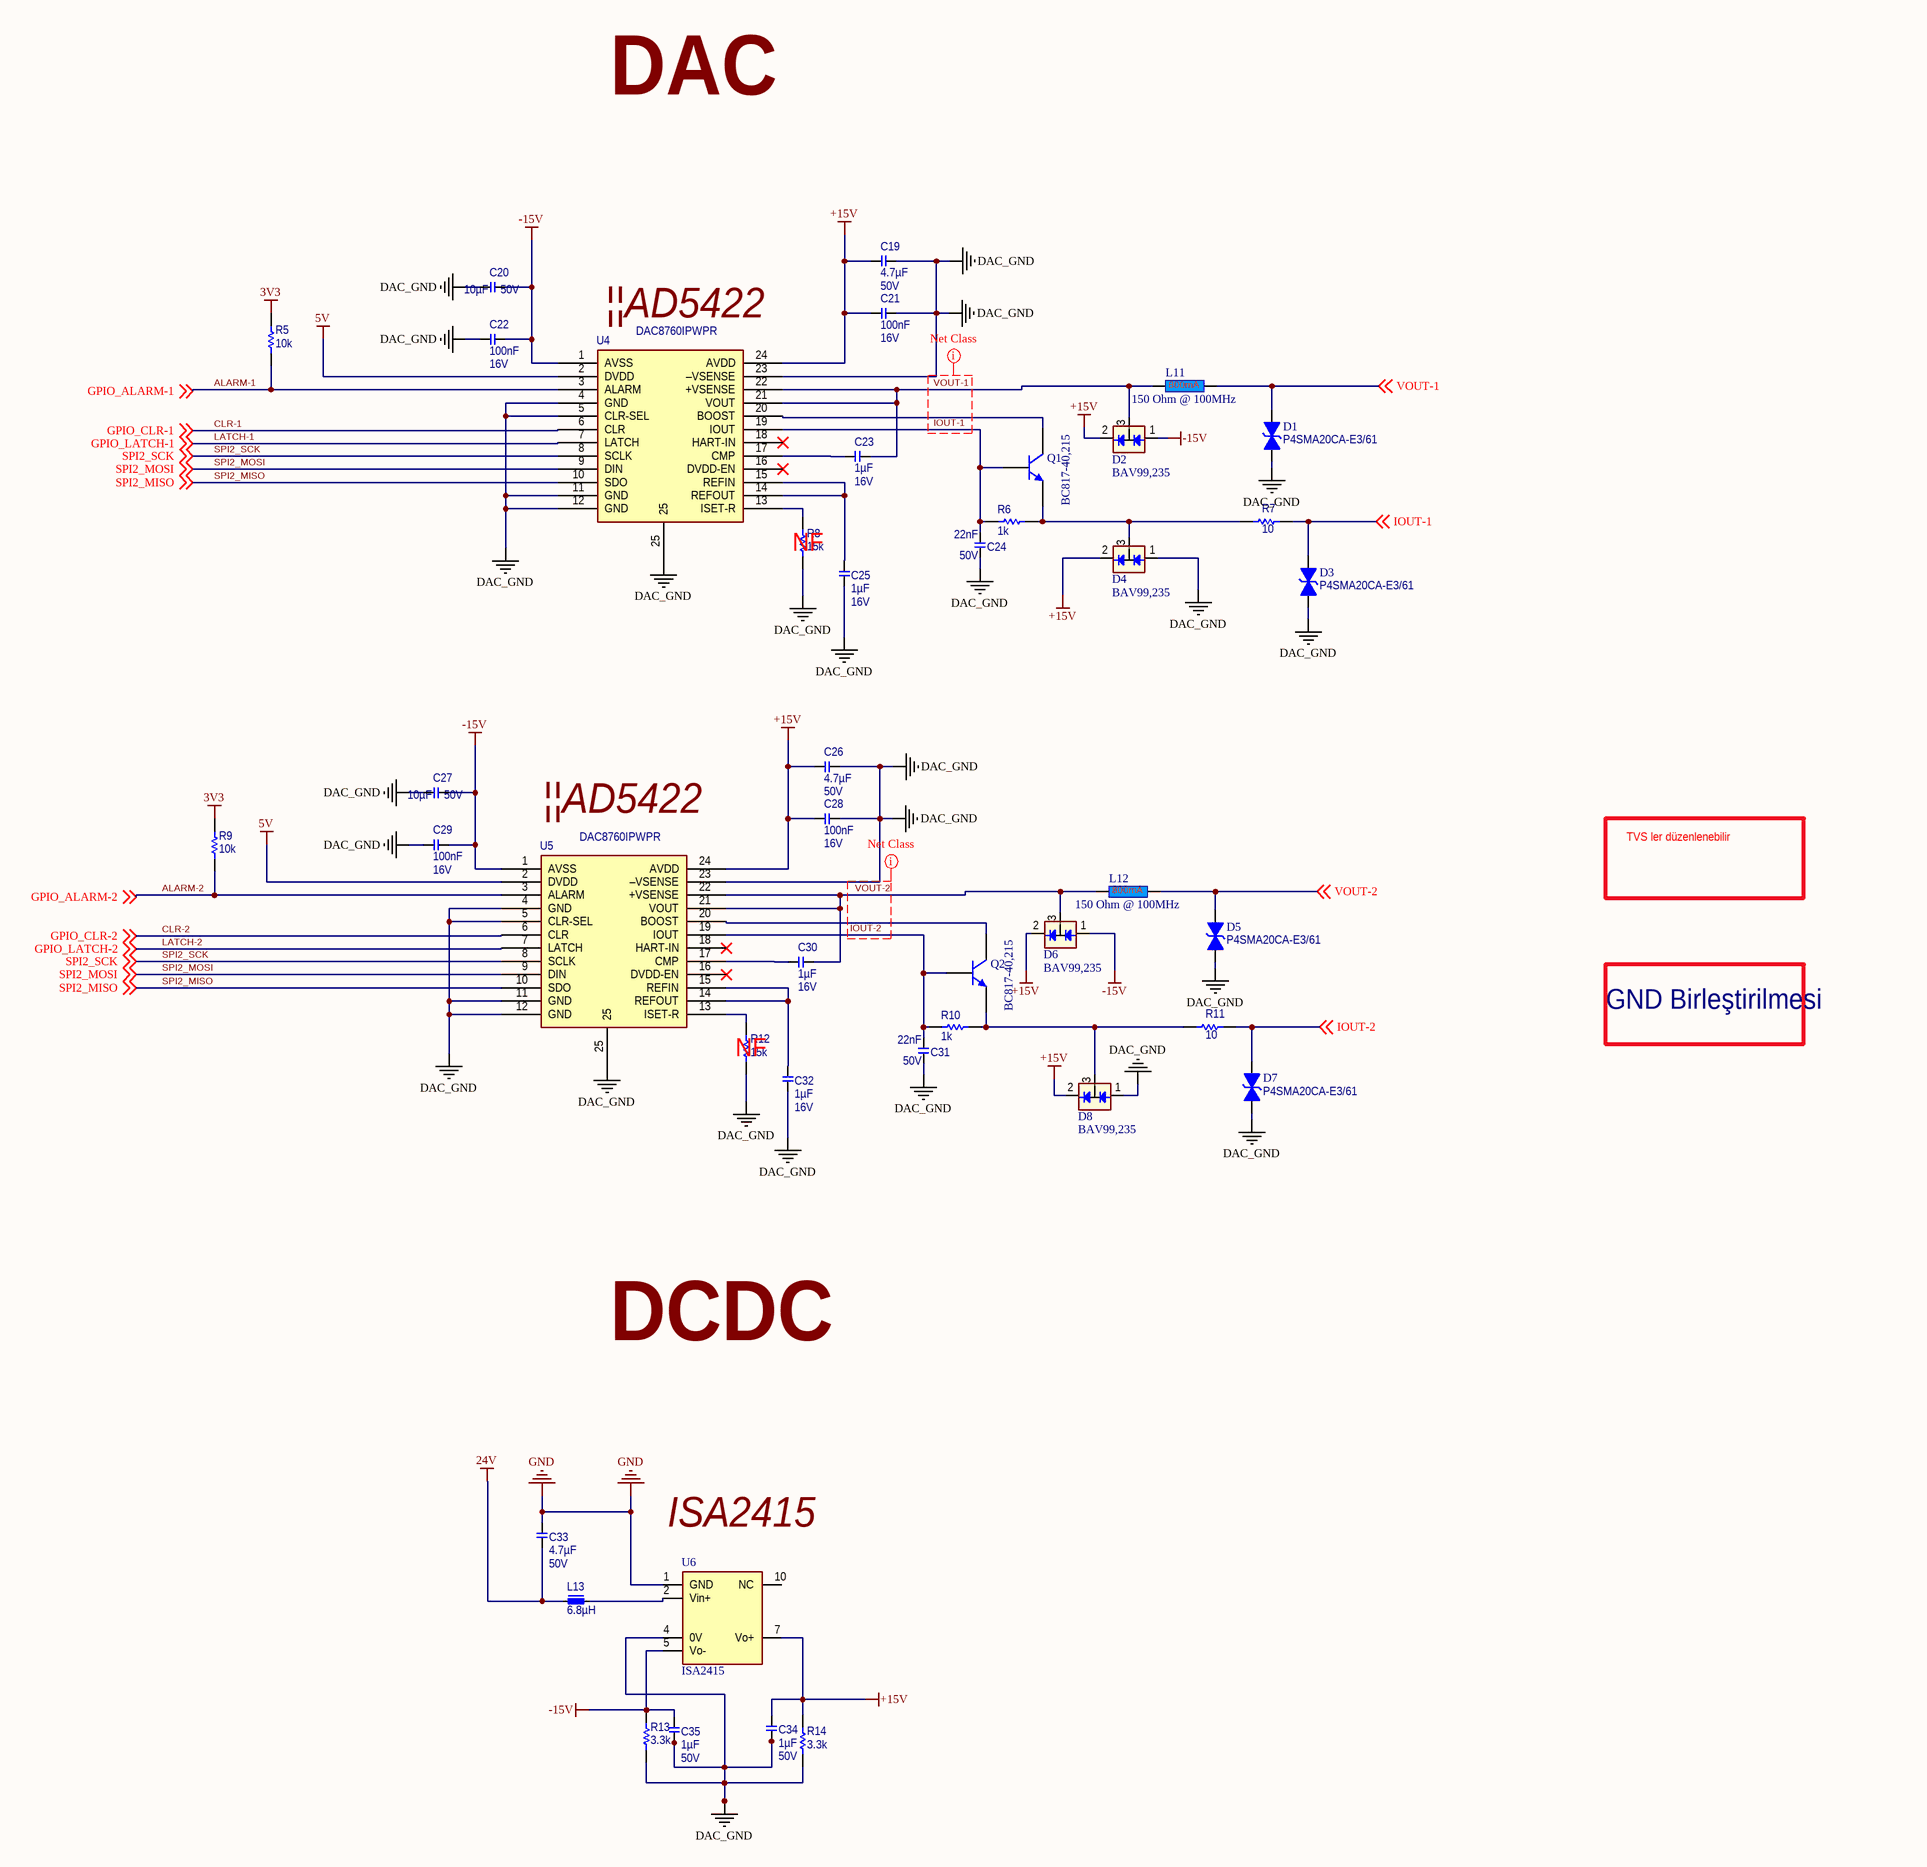
[diagram p2: [03] - DAC8760.SchDoc]

### Parts
C19  Capacitance: 4.7µF  Voltage - Rated: 50V  [C1206]  (hidden comment: 4.7UF 50V X7R)
C20  Capacitance: 10µF  Voltage - Rated: 50V  [C0805]  (hidden comment: 10UF 50V X5R)
C21  Voltage - Rated: 16V  [C0805]  (hidden comment: 100nF)
C22  Voltage - Rated: 16V  [C0805]  (hidden comment: 100nF)
C23  Voltage - Rated: 16V  [C0805]  (hidden comment: 1µF)
C24  Capacitance: 22nF  Voltage - Rated: 50V  [C0805]  (hidden comment: 22NF 50V X7R)
C25  Voltage - Rated: 16V  [C0805]  (hidden comment: 1µF)
C26  Capacitance: 4.7µF  Voltage - Rated: 50V  [C1206]  (hidden comment: 4.7UF 50V X7R)
C27  Capacitance: 10µF  Voltage - Rated: 50V  [C0805]  (hidden comment: 10UF 50V X5R)
C28  Voltage - Rated: 16V  [C0805]  (hidden comment: 100nF)
C29  Voltage - Rated: 16V  [C0805]  (hidden comment: 100nF)
C30  Voltage - Rated: 16V  [C0805]  (hidden comment: 1µF)
C31  Capacitance: 22nF  Voltage - Rated: 50V  [C0805]  (hidden comment: 22NF 50V X7R)
C32  Voltage - Rated: 16V  [C0805]  (hidden comment: 1µF)
C33  Capacitance: 4.7µF  Voltage - Rated: 50V  [C1206]  (hidden comment: 4.7UF 50V X7R)
C34  Capacitance: 1µF  Voltage - Rated: 50V  [C0805]  (hidden comment: 1UF 50V X7R)
C35  Capacitance: 1µF  Voltage - Rated: 50V  [C0805]  (hidden comment: 1UF 50V X7R)
D1  Manufacturer Part Number: P4SMA20CA-E3/61  [DO-214Ac]  (hidden comment: TVS DIODE 15VWM 24.4VC SMC)
D2  Manufacturer Part Number: BAV99,235  [SOT23-3 - Number]  (hidden comment: BAV99)
D3  Manufacturer Part Number: P4SMA20CA-E3/61  [DO-214Ac]  (hidden comment: TVS DIODE 15VWM 24.4VC SMC)
D4  Manufacturer Part Number: BAV99,235  [SOT23-3 - Number]  (hidden comment: BAV99)
D5  Manufacturer Part Number: P4SMA20CA-E3/61  [DO-214Ac]  (hidden comment: TVS DIODE 15VWM 24.4VC SMC)
D6  Manufacturer Part Number: BAV99,235  [SOT23-3 - Number]  (hidden comment: BAV99)
D7  Manufacturer Part Number: P4SMA20CA-E3/61  [DO-214Ac]  (hidden comment: TVS DIODE 15VWM 24.4VC SMC)
D8  Manufacturer Part Number: BAV99,235  [SOT23-3 - Number]  (hidden comment: BAV99)
L11  150 Ohm @ 100MHz  [0805]
L12  150 Ohm @ 100MHz  [0805]
L13  Inductance: 6.8µH  [0805]  (hidden comment: 6.8UH 550MA)
Q1  BC817-40,215  [SO-G3/Y1]
Q2  BC817-40,215  [SO-G3/Y1]
R5  Resistance (Ohms): 10k  [R0805]  (hidden comment: R-10K,%1,0805)
R6  Resistance (Ohms): 1k  [R0805]  (hidden comment: R-1K,0805)
R7  Resistance (Ohms): 10  [R0805]  (hidden comment: 10 OHM)
R8  Resistance (Ohms): 15k  [R0805]  (hidden comment: 15K OHM)
R9  Resistance (Ohms): 10k  [R0805]  (hidden comment: R-10K,%1,0805)
R10  Resistance (Ohms): 1k  [R0805]  (hidden comment: R-1K,0805)
R11  Resistance (Ohms): 10  [R0805]  (hidden comment: 10 OHM)
R12  Resistance (Ohms): 15k  [R0805]  (hidden comment: 15K OHM)
R13  Resistance (Ohms): 3.3k  [R0805]  (hidden comment: 3.3K OHM 0805)
R14  Resistance (Ohms): 3.3k  [R0805]  (hidden comment: 3.3K OHM 0805)
U4  Manufacturer Part Number: DAC8760IPWPR  [TSSOP-24]  (hidden comment: IC-DAC8760IPWPR)
U5  Manufacturer Part Number: DAC8760IPWPR  [TSSOP-24]  (hidden comment: IC-DAC8760IPWPR)
U6  DC/DC CONV  [ISA2415]  (value not drawn)

### Nets
3V3: R5.2 R9.2
5V: U4.2(DVDD) U5.2(DVDD)
24V: C33.1 L13.1
+15V: C19.1 C21.1 C26.1 C28.1 C34.2 D2.2(D-) D4.2(D-) D6.2(D-) D8.2(D-) R14.2 U4.24(AVDD) U5.24(AVDD) U6.7(Vo+)
-15V: C20.2 C22.2 C27.2 C29.2 C35.2 D2.1(D+) D6.1(D+) R13.2 U4.1(AVSS) U5.1(AVSS) U6.5(Vo-)
DAC_GND: C19.2 C20.1 C21.2 C22.1 C24.1 C25.1 C26.2 C27.1 C28.2 C29.1 C31.1 C32.1 C34.1 C35.1 D1.2(ANODE) D3.2(ANODE) D4.1(D+) D5.2(ANODE) D7.2(ANODE) D8.1(D+) R8.1 R12.1 R13.1 R14.1 U4.4(GND) U4.5(CLR-SEL) U4.11(GND) U4.12(GND) U4.23(–VSENSE) U4.25 U5.4(GND) U5.5(CLR-SEL) U5.11(GND) U5.12(GND) U5.23(–VSENSE) U5.25 U6.4(0V)
GND: C33.2 U6.1(GND)
ALARM-1: R5.1 U4.3(ALARM) ; off-sheet GPIO_ALARM-1  [also labelled GPIO_ALARM-1]
ALARM-2: R9.1 U5.3(ALARM) ; off-sheet GPIO_ALARM-2  [also labelled GPIO_ALARM-2]
CLR-1: U4.6(CLR) ; off-sheet GPIO_CLR-1  [also labelled GPIO_CLR-1]
CLR-2: U5.6(CLR) ; off-sheet GPIO_CLR-2  [also labelled GPIO_CLR-2]
IOUT-1: C24.2 D3.1(CATHODE) Q1.1(B) R6.1 R7.2 U4.19(IOUT) ; off-sheet IOUT-1
IOUT-2: C31.2 D7.1(CATHODE) Q2.1(B) R10.1 R11.2 U5.19(IOUT) ; off-sheet IOUT-2
LATCH-1: U4.7(LATCH) ; off-sheet GPIO_LATCH-1  [also labelled GPIO_LATCH-1]
LATCH-2: U5.7(LATCH) ; off-sheet GPIO_LATCH-2  [also labelled GPIO_LATCH-2]
SPI2_MISO: U4.10(SDO) U5.10(SDO) ; off-sheet SPI2_MISO
SPI2_MOSI: U4.9(DIN) U5.9(DIN) ; off-sheet SPI2_MOSI
SPI2_SCK: U4.8(SCLK) U5.8(SCLK) ; off-sheet SPI2_SCK
VOUT-1: C23.2 D1.1(CATHODE) D2.3 L11.1 L11.2 U4.21(VOUT) U4.22(+VSENSE) ; off-sheet VOUT-1
VOUT-2: C30.2 D5.1(CATHODE) D6.3 L12.1 L12.2 U5.21(VOUT) U5.22(+VSENSE) ; off-sheet VOUT-2
NetC23_1: C23.1 U4.17(CMP)
NetC25_2: C25.2 U4.14(REFOUT) U4.15(REFIN)
NetC30_1: C30.1 U5.17(CMP)
NetC32_2: C32.2 U5.14(REFOUT) U5.15(REFIN)
NetD4_3: D4.3 Q1.2(E) R6.2 R7.1
NetD8_3: D8.3 Q2.2(E) R10.2 R11.1
NetL13_2: L13.2 U6.2(Vin+)
NetQ1_3: Q1.3(C) U4.20(BOOST)
NetQ2_3: Q2.3(C) U5.20(BOOST)
NetR8_2: R8.2 U4.13(ISET-R)
NetR12_2: R12.2 U5.13(ISET-R)

Not connected (* = marked no-connect by the designer): U4 16(DVDD-EN)* 18(HART-IN)*; U5 16(DVDD-EN)* 18(HART-IN)*; U6 10(NC)

### Layout directives
net class DAC_OUT: IOUT-1, IOUT-2, VOUT-1, VOUT-2

### Notes on the sheet
- DAC
- (near U4) ||AD5422
- (near R8) NF
- (near U5) ||AD5422
- TVS ler düzenlenebilir
- GND Birleştirilmesi
- (near R12) NF
- DCDC
- (near U6) ISA2415

### Library data of the parts
C19 C26 C33 = C-4.7UF,50V,1206: CAP CER 4.7UF 50V X7R 1206; Manufacturer: Samsung Electro-Mechanics America, Inc.; Manufacturer Part Number: CL31B475KBHNNNE; Tolerance: ±10%; Supplier 1: Digi-Key; RoHS: RoHS Compliant; Category: Capacitors; Stock 1: 128633; Pricing 1: 1=0.34, 10=0.28, 25=0.1928, 50=0.1576, 100=0.1401, 500=0.0928, 1000=0.0823 (USD); Packaging: Digi-Reel®; Temperature Coefficient: X7R; Mounting Type: Surface Mount, MLCC; Operating Temperature: -55°C ~ 125°C; Applications: General Purpose; Ratings: -; Package / Case: 1206 (3216 Metric); Size / Dimension: 0.126" L x 0.063" W (3.20mm x 1.60mm); Height - Seated (Max): -; Thickness (Max): 0.071" (1.80mm); Lead Spacing: -; Features: -; Lead Style: -; ComponentLink1URL: http://www.samsungsem.com/kr/support/product-search/mlcc/CL31B475KBHNNNE.jsp; ComponentLink1Description: http://www.samsungsem.com/kr/support/product-search/mlcc/CL31B475KBHNNNE.jsp; Supplier Part Number 1: 1276-2789-6-ND
C20 C27 = C-10UF,50V,0805: CAP CER 10UF 50V X7R 1206; Manufacturer: Samsung Electro-Mechanics America, Inc.; Manufacturer Part Number: CL31B106KBHNNNE; Tolerance: ±10%; Supplier 1: Digi-Key; RoHS: RoHS Compliant; Category: Capacitors; Stock 1: 0; Pricing 1: 1=0.33, 10=0.29, 50=0.176, 100=0.1449, 500=0.1056, 1000=0.09524 (USD); Packaging: Cut Tape (CT); Temperature Coefficient: X7R; Mounting Type: Surface Mount, MLCC; Operating Temperature: -55°C ~ 125°C; Applications: General Purpose; Ratings: -; Package / Case: 1206 (3216 Metric); Size / Dimension: 0.126" L x 0.063" W (3.20mm x 1.60mm); Height - Seated (Max): -; Thickness (Max): 0.071" (1.80mm); Lead Spacing: -; Features: -; Lead Style: -; ComponentLink1URL: http://media.digikey.com/pdf/Data%20Sheets/Samsung%20PDFs/CL_Series_MLCC_ds.pdf; ComponentLink1Description: http://media.digikey.com/pdf/Data%20Sheets/Samsung%20PDFs/CL_Series_MLCC_ds.pdf; Supplier Part Number 1: 1276-6767-1-ND
C21 C22 C28 C29 = C-100NF,16V,0805: as C7 on sheet [02] - AD7734; Manufacturer: AVX; Manufacturer Part Number: 0805YA103JAT2A; RoHS: YES; ComponentLink1URL: http://www.avx.com/docs/Catalogs/ccog.pdf; ComponentLink1Description: http://www.avx.com/docs/Catalogs/ccog.pdf; ComponentLink2URL: http://www.farnell.com/datasheets/1825494.pdf; ComponentLink2Description: http://www.farnell.com/datasheets/1825494.pdf; Supplier 1: Digi-Key; Category: Capacitors; Stock 1: 28062; Pricing 1: 1=0.29, 10=0.204, 25=0.1668, 50=0.1424, 100=0.1221, 250=0.10176, 500=0.09158, 1000=0.07733 (USD); Packaging: Cut Tape (CT); Mounting Type: Surface Mount, MLCC; Operating Temperature: -55°C ~ 125°C; Applications: General Purpose; Ratings: -; Package / Case: 0805 (2012 Metric); Size / Dimension: 0.079" L x 0.049" W (2.01mm x 1.25mm); Height - Seated (Max): -; Thickness (Max): 0.037" (0.94mm); Lead Spacing: -; Features: -; Lead Style: -; ComponentLink3URL: http://datasheets.avx.com/C0GNP0-Dielectric.pdf; ComponentLink3Description: http://datasheets.avx.com/C0GNP0-Dielectric.pdf; Supplier Part Number 1: 478-1334-1-ND; Capacitance: 100nF
C23 C25 C30 C32 = C-1UF,16V,0805: AVX - 0805YC105KAT2A - CAP, MLCC, X7R, 1UF, 16V, 0805; Manufacturer: AVX Corporation; Tolerance: ±10%; Supplier 1: Digi-Key; Manufacturer Part Number: 0805YC105KAT2A; RoHS: RoHS Compliant; Category: Capacitors; Stock 1: 76930; Pricing 1: 1=0.19, 10=0.132, 25=0.0964, 50=0.075, 100=0.0622, 250=0.05148, 500=0.04362, 1000=0.03611 (USD); Packaging: Cut Tape (CT); Temperature Coefficient: X7R; Mounting Type: Surface Mount, MLCC; Operating Temperature: -55°C ~ 125°C; Applications: General Purpose; Ratings: -; Package / Case: 0805 (2012 Metric); Size / Dimension: 0.079" L x 0.049" W (2.01mm x 1.25mm); Height - Seated (Max): -; Thickness (Max): 0.055" (1.40mm); Lead Spacing: -; Features: -; Lead Style: -; ComponentLink1URL: http://datasheets.avx.com/X7RDielectric.pdf; ComponentLink1Description: http://datasheets.avx.com/X7RDielectric.pdf; Supplier Part Number 1: 478-5034-1-ND; Capacitance: 1µF
C24 C31 = C-22NF,50V: CAP CER 0.022UF 50V X7R 0805; Manufacturer: Kemet; Manufacturer Part Number: C0805C223K5RACTU; Tolerance: ±10%; Supplier 1: Digi-Key; RoHS: RoHS Compliant; Category: Capacitors; Stock 1: 126853; Pricing 1: 1=0.1, 10=0.064, 50=0.0344, 100=0.0292, 250=0.02384, 500=0.0204, 1000=0.0159 (USD); Packaging: Cut Tape (CT); Temperature Coefficient: X7R; Mounting Type: Surface Mount, MLCC; Operating Temperature: -55°C ~ 125°C; Applications: General Purpose; Ratings: -; Package / Case: 0805 (2012 Metric); Size / Dimension: 0.079" L x 0.049" W (2.00mm x 1.25mm); Height - Seated (Max): -; Thickness (Max): 0.035" (0.88mm); Lead Spacing: -; Features: Low ESL; Lead Style: -; ComponentLink1URL: http://www.kemet.com/docfinder?Partnumber=C0805C223K5RACTU; ComponentLink1Description: http://www.kemet.com/docfinder?Partnumber=C0805C223K5RACTU; Supplier Part Number 1: 399-1163-1-ND
C34 C35 = C-1UF,50V: CAP CER 1UF 50V X7R 0805; Manufacturer: Samsung Electro-Mechanics America, Inc.; Manufacturer Part Number: CL21B105KBFNNNE; Tolerance: ±10%; Supplier 1: Digi-Key; RoHS: RoHS Compliant; Category: Capacitors; Stock 1: 162738; Pricing 1: 1=0.21, 10=0.143, 25=0.104, 50=0.0866, 100=0.0727, 500=0.05194, 1000=0.04414 (USD); Packaging: Digi-Reel®; Temperature Coefficient: X7R; Mounting Type: Surface Mount, MLCC; Operating Temperature: -55°C ~ 125°C; Applications: General Purpose; Ratings: -; Package / Case: 0805 (2012 Metric); Size / Dimension: 0.079" L x 0.049" W (2.00mm x 1.25mm); Height - Seated (Max): -; Thickness (Max): 0.053" (1.35mm); Lead Spacing: -; Features: -; Lead Style: -; ComponentLink1URL: http://www.samsungsem.com/kr/support/product-search/mlcc/CL21B105KBFNNNE.jsp; ComponentLink1Description: http://www.samsungsem.com/kr/support/product-search/mlcc/CL21B105KBFNNNE.jsp; Supplier Part Number 1: 1276-1029-6-ND
D1 D3 D5 D7 = D-P4SMA20CA TVS DIODE: TVS DIODE 17.1VWM 27.7VC SMA; Manufacturer: Vishay Semiconductor Diodes Division; Type: Zener; Bidirectional Channels: 1; Voltage - Reverse Standoff (Typ): 17.1V; Voltage - Breakdown (Min): 19V; Voltage - Clamping (Max) @ Ipp: 27.7V; Current - Peak Pulse (10/1000µs): 14.4A; Power - Peak Pulse: 400W; Power Line Protection: No; Supplier 1: Digi-Key; RoHS: RoHS Compliant; Category: Circuit Protection; Stock 1: 729; Pricing 1: 1=0.36, 10=0.29, 25=0.2656, 100=0.1978, 250=0.17924, 500=0.14832 (USD); Packaging: Digi-Reel®; Part Status: Active; Unidirectional Channels: -; Applications: General Purpose; Capacitance @ Frequency: -; Operating Temperature: -65°C ~ 150°C (TJ); Mounting Type: Surface Mount; Package / Case: DO-214AC, SMA; Supplier Device Package: DO-214AC (SMA); ComponentLink1URL: http://www.vishay.com/docs/88367/p4sma.pdf; ComponentLink1Description: http://www.vishay.com/docs/88367/p4sma.pdf; Supplier Part Number 1: P4SMA20CA-E3/61GIDKR-ND
D2 D4 D6 D8 = D-BAV99,235: DIODE ARRAY GP 100V 215MA SOT23; Manufacturer: NXP Semiconductors; Diode Configuration: 1 Pair Series Connection; Diode Type: Standard; Current - Average Rectified (Io) (per Diode): 215mA (DC); Voltage - Forward (Vf) (Max) @ If: 1.25V @ 150mA; Speed: Fast Recovery =< 500ns, > 200mA (Io); Reverse Recovery Time (trr): 4ns; Current - Reverse Leakage @ Vr: 500nA @ 80V; Supplier 1: Digi-Key; RoHS: RoHS Compliant; Category: Discrete Semiconductor Products; Stock 1: 40000; Pricing 1: 10000=0.017, 30000=0.0153, 50000=0.0136, 100000=0.01275, 250000=0.01131 (USD); Packaging: Tape & Reel (TR); Voltage - DC Reverse (Vr) (Max): 100V; Mounting Type: Surface Mount; Package / Case: TO-236-3, SC-59, SOT-23-3; Supplier Device Package: SOT-23 (TO-236AB); ComponentLink1URL: http://www.nxp.com/documents/data_sheet/BAV99_SER.pdf; ComponentLink1Description: http://www.nxp.com/documents/data_sheet/BAV99_SER.pdf; Supplier Part Number 1: 568-5005-2-ND
L11 L12 = L-150OHM,800MA: as L1 on sheet [02] - AD7734; Supplier 1: Digi-Key; RoHS: RoHS Compliant; Category: Filters; Stock 1: 418596; Pricing 1: 1=0.1, 10=0.07, 25=0.064, 50=0.0574, 100=0.0421, 250=0.03064, 500=0.02808, 1000=0.02424 (USD); Packaging: Cut Tape (CT); Current Rating: 800mA; Package / Case: 0805 (2012 Metric); Mounting Type: Surface Mount; Height (Max): 0.043" (1.10mm); Size / Dimension: 0.079" L x 0.049" W (2.00mm x 1.25mm); ComponentLink1URL: http://www.lairdtech.com/WorkArea/linkit.aspx?LinkIdentifier=id&ItemID=4912; ComponentLink1Description: http://www.lairdtech.com/WorkArea/linkit.aspx?LinkIdentifier=id&ItemID=4912; Supplier Part Number 1: 240-2384-1-ND; Impedance @ Frequency: 150 Ohm @ 100MHz
L13 = L-6.8UH,550mA,0805: FIXED IND 6.8UH 550MA 250 MOHM; Manufacturer: TDK Corporation; Manufacturer Part Number: MLZ2012N6R8LT000; Type: Multilayer; Material - Core: Ferrite; Tolerance: ±20%; Current - Saturation: 110mA; Shielding: Shielded; Frequency - Self Resonant: 60MHz; Frequency - Test: 2MHz; Supplier 1: Digi-Key; RoHS: RoHS Compliant; Category: Inductors, Coils, Chokes; Stock 1: 11951; Pricing 1: 1=0.14, 10=0.125, 50=0.0976, 100=0.0875, 500=0.075, 1000=0.065 (USD); Packaging: Digi-Reel®; Part Status: Active; Current Rating: 550mA; DC Resistance (DCR): 250 mOhm; Q @ Freq: -; Ratings: -; Operating Temperature: -55°C ~ 125°C; Mounting Type: Surface Mount; Package / Case: 0805 (2012 Metric); Size / Dimension: 0.079" L x 0.049" W (2.00mm x 1.25mm); Height - Seated (Max): 0.057" (1.45mm); ComponentLink1URL: https://product.tdk.com/info/en/catalog/datasheets/inductor_commercial_decoupling_mlz2012_en.pdf; ComponentLink1Description: https://product.tdk.com/info/en/catalog/datasheets/inductor_commercial_decoupling_mlz2012_en.pdf; Supplier Part Number 1: 445-6761-6-ND
Q1 Q2 = T-BC817-40 NPN: TRANS NPN 45V 0.5A SOT23; Manufacturer: NXP Semiconductors; Current - Collector (Ic) (Max): 500mA; Vce Saturation (Max) @ Ib, Ic: 700mV @ 50mA, 500mA; Current - Collector Cutoff (Max): 100nA (ICBO); DC Current Gain (hFE) (Min) @ Ic, Vce: 250 @ 100mA, 1V; Power - Max: 250mW; Frequency - Transition: 100MHz; Supplier 1: Digi-Key; RoHS: RoHS Compliant; Category: Discrete Semiconductor Products; Stock 1: 130982; Pricing 1: 1=0.14, 10=0.127, 100=0.0693, 500=0.04258, 1000=0.02905 (USD); Packaging: Cut Tape (CT); Transistor Type: NPN; Voltage - Collector Emitter Breakdown (Max): 45V; Mounting Type: Surface Mount; Package / Case: TO-236-3, SC-59, SOT-23-3; Supplier Device Package: SOT-23 (TO-236AB); ComponentLink1URL: http://www.nxp.com/documents/data_sheet/BC817_BC817W_BC337.pdf; ComponentLink1Description: http://www.nxp.com/documents/data_sheet/BC817_BC817W_BC337.pdf; Supplier Part Number 1: 568-1631-1-ND; Manufacturer Part Number: BC817-40,215
R5 R9 = R-10K,%1,0805: RES SMD 10K OHM 1% 1/8W 0805; Manufacturer: Yageo; Manufacturer Part Number: RC0805FR-0710KL; Power (Watts): 0.125W, 1/8W; Temperature Coefficient: ±100ppm/°C; Supplier 1: Digi-Key; RoHS: RoHS Compliant; Category: Resistors; Stock 1: 4020575; Pricing 1: 1=0.1, 10=0.021, 25=0.0152, 100=0.0084, 250=0.00644, 500=0.00514, 1000=0.00379, 2500=0.00329 (USD); Packaging: Cut Tape (CT); Tolerance: ±1%; Composition: Thick Film; Features: Moisture Resistant; Operating Temperature: -55°C ~ 155°C; Package / Case: 0805 (2012 Metric); Supplier Device Package: 0805; Size / Dimension: 0.079" L x 0.049" W (2.00mm x 1.25mm); Height: 0.024" (0.60mm); Number of Terminations: 2; ComponentLink1URL: http://www.yageo.com/documents/recent/PYu-RC_Group_51_RoHS_L_04.pdf; ComponentLink1Description: http://www.yageo.com/documents/recent/PYu-RC_Group_51_RoHS_L_04.pdf; Supplier Part Number 1: 311-10.0KCRCT-ND
R6 R10 = R-1K,0805: BOURNS - CR0805-FX-1001ELF - RESISTOR, 1K, 0.125W, 1%; Manufacturer: Bourns Inc.; Power (Watts): 0.125W, 1/8W; Temperature Coefficient: ±100ppm/°C; Supplier 1: Digi-Key; Manufacturer Part Number: CR0805-FX-1001ELF; RoHS: RoHS Compliant; Category: Resistors; Stock 1: 68774; Pricing 1: 1=0.1, 10=0.069, 25=0.05, 50=0.038, 100=0.028, 250=0.0214, 500=0.0171, 1000=0.01259, 2500=0.01093 (USD); Packaging: Cut Tape (CT); Tolerance: ±1%; Composition: Thick Film; Features: Moisture Resistant; Operating Temperature: -55°C ~ 155°C; Package / Case: 0805 (2012 Metric); Supplier Device Package: 0805; Size / Dimension: 0.079" L x 0.049" W (2.00mm x 1.25mm); Height: 0.024" (0.60mm); Number of Terminations: 2; ComponentLink1URL: http://www.bourns.com/docs/Product-Datasheets/CHPREZTR.pdf; ComponentLink1Description: http://www.bourns.com/docs/Product-Datasheets/CHPREZTR.pdf; Supplier Part Number 1: CR0805-FX-1001ELFCT-ND
R7 R11 = R-10R,0805: RES SMD 10 OHM 1% 1/8W 0805; Manufacturer: Yageo; Manufacturer Part Number: RC0805FR-0710RL; Power (Watts): 0.125W, 1/8W; Temperature Coefficient: ±200ppm/°C; Supplier 1: Digi-Key; RoHS: RoHS Compliant; Category: Resistors; Stock 1: 702652; Pricing 1: 1=0.1, 10=0.021, 25=0.0152, 100=0.0084, 250=0.00644, 500=0.00514, 1000=0.00379, 2500=0.00329 (USD); Packaging: Digi-Reel®; Tolerance: ±1%; Composition: Thick Film; Features: Moisture Resistant; Operating Temperature: -55°C ~ 155°C; Package / Case: 0805 (2012 Metric); Supplier Device Package: 0805; Size / Dimension: 0.079" L x 0.049" W (2.00mm x 1.25mm); Height: 0.024" (0.60mm); Number of Terminations: 2; ComponentLink1URL: http://www.yageo.com/documents/recent/PYu-RC_Group_51_RoHS_L_04.pdf; ComponentLink1Description: http://www.yageo.com/documents/recent/PYu-RC_Group_51_RoHS_L_04.pdf; Supplier Part Number 1: 311-10.0CRDKR-ND
R8 R12 = R-15k,0805: RES SMD 15K OHM 5% 1/8W 0805; Manufacturer: Yageo; Manufacturer Part Number: RC0805JR-0715KL; Power (Watts): 0.125W, 1/8W; Temperature Coefficient: ±100ppm/°C; Supplier 1: Digi-Key; RoHS: RoHS Compliant; Category: Resistors; Stock 1: 97321; Pricing 1: 1=0.1, 10=0.018, 25=0.0128, 100=0.0073, 250=0.00556, 500=0.00444, 1000=0.00326, 2500=0.00283 (USD); Packaging: Cut Tape (CT); Tolerance: ±5%; Composition: Thick Film; Features: Moisture Resistant; Operating Temperature: -55°C ~ 155°C; Package / Case: 0805 (2012 Metric); Supplier Device Package: 0805; Size / Dimension: 0.079" L x 0.049" W (2.00mm x 1.25mm); Height: 0.024" (0.60mm); Number of Terminations: 2; ComponentLink1URL: http://www.yageo.com/documents/recent/PYu-RC_Group_51_RoHS_L_04.pdf; ComponentLink1Description: http://www.yageo.com/documents/recent/PYu-RC_Group_51_RoHS_L_04.pdf; Supplier Part Number 1: 311-15KARCT-ND
R13 R14 = R-3.3K,0805: RES SMD 3.3K OHM 5% 1/8W 0805; Manufacturer: Yageo; Manufacturer Part Number: RC0805JR-073K3L; Power (Watts): 0.125W, 1/8W; Temperature Coefficient: ±100ppm/°C; Supplier 1: Digi-Key; RoHS: RoHS Compliant; Category: Resistors; Stock 1: 439567; Pricing 1: 1=0.1, 10=0.018, 25=0.0128, 100=0.0073, 250=0.00556, 500=0.00444, 1000=0.00326, 2500=0.00283 (USD); Packaging: Digi-Reel®; Tolerance: ±5%; Composition: Thick Film; Features: Moisture Resistant; Operating Temperature: -55°C ~ 155°C; Package / Case: 0805 (2012 Metric); Supplier Device Package: 0805; Size / Dimension: 0.079" L x 0.049" W (2.00mm x 1.25mm); Height: 0.024" (0.60mm); Number of Terminations: 2; ComponentLink1URL: http://www.yageo.com/documents/recent/PYu-RC_Group_51_RoHS_L_04.pdf; ComponentLink1Description: http://www.yageo.com/documents/recent/PYu-RC_Group_51_RoHS_L_04.pdf; Supplier Part Number 1: 311-3.3KARDKR-ND
U4 U5 = IC-DAC8760IPWPR: IC DAC 1CH 16BIT PROGR 24HTSSOP; Manufacturer: Texas Instruments; Number of Bits: 16; Number of D/A Converters: 1; Settling Time: 25µs (Typ); Output Type: Voltage or Current - Buffered; Differential Output: No; Data Interface: SPI, DSP; Reference Type: External, Internal; Voltage - Supply, Analog: 10 V ~ 36 V, -18V; Voltage - Supply, Digital: 2.7 V ~ 5.5 V; INL/DNL (LSB): -, ±1 (Max); Architecture: String DAC; Supplier 1: Digi-Key; RoHS: RoHS Compliant; Category: Integrated Circuits (ICs); Stock 1: 386; Pricing 1: 1=8.8, 10=7.972, 100=6.5715, 500=5.7456, 1000=4.48875 (USD); Packaging: Cut Tape (CT); Operating Temperature: -40°C ~ 125°C; Package / Case: 24-TSSOP (0.173", 4.40mm Width) Exposed Pad; Supplier Device Package: 24-HTSSOP; ComponentLink1URL: http://www.ti.com/lit/ds/symlink/dac8760.pdf; ComponentLink1Description: http://www.ti.com/lit/ds/symlink/dac8760.pdf; Supplier Part Number 1: 296-37189-1-ND
U6 = IC-ISA2415: DC/DC CONV 1W SMD DUAL OUT; Manufacturer: XP Power; Number of Outputs: 2; Voltage - Input (Min): 21.6V; Voltage - Input (Max): 26.4V; Voltage - Output 1: 15V; Voltage - Output 2: -15V; Current - Output (Max): 33mA, 33mA; Voltage - Isolation: 1.5kV (1500V); Efficiency: 82%; Supplier 1: Digi-Key; RoHS: RoHS Compliant; Category: Power Supplies - Board Mount; Stock 1: 223; Pricing 1: 1=4.75, 5=4.61, 10=4.47, 25=4.28, 100=3.99, 500=3.71002 (USD); Packaging: Tube; Type: Isolated Module; Voltage - Output 3: -; Power (Watts) - Manufacture Series: 1W; Applications: ITE (Commercial); Features: SCP; Mounting Type: Surface Mount; Package / Case: 10-SMD Module (6 Leads); Size / Dimension: 0.60" L x 0.33" W x 0.29" H (15.2mm x 8.3mm x 7.3mm); Operating Temperature: -40°C ~ 105°C; Power (Watts) - Max: 1W; ComponentLink1URL: http://www.xppower.com/Portals/0/pdfs/SF_ISA.pdf; ComponentLink1Description: http://www.xppower.com/Portals/0/pdfs/SF_ISA.pdf; Supplier Part Number 1: 1470-2970-5-ND; Manufacturer Part Number: ISA2415

## Sheet [04] - miniPCI.SchDoc
size A3
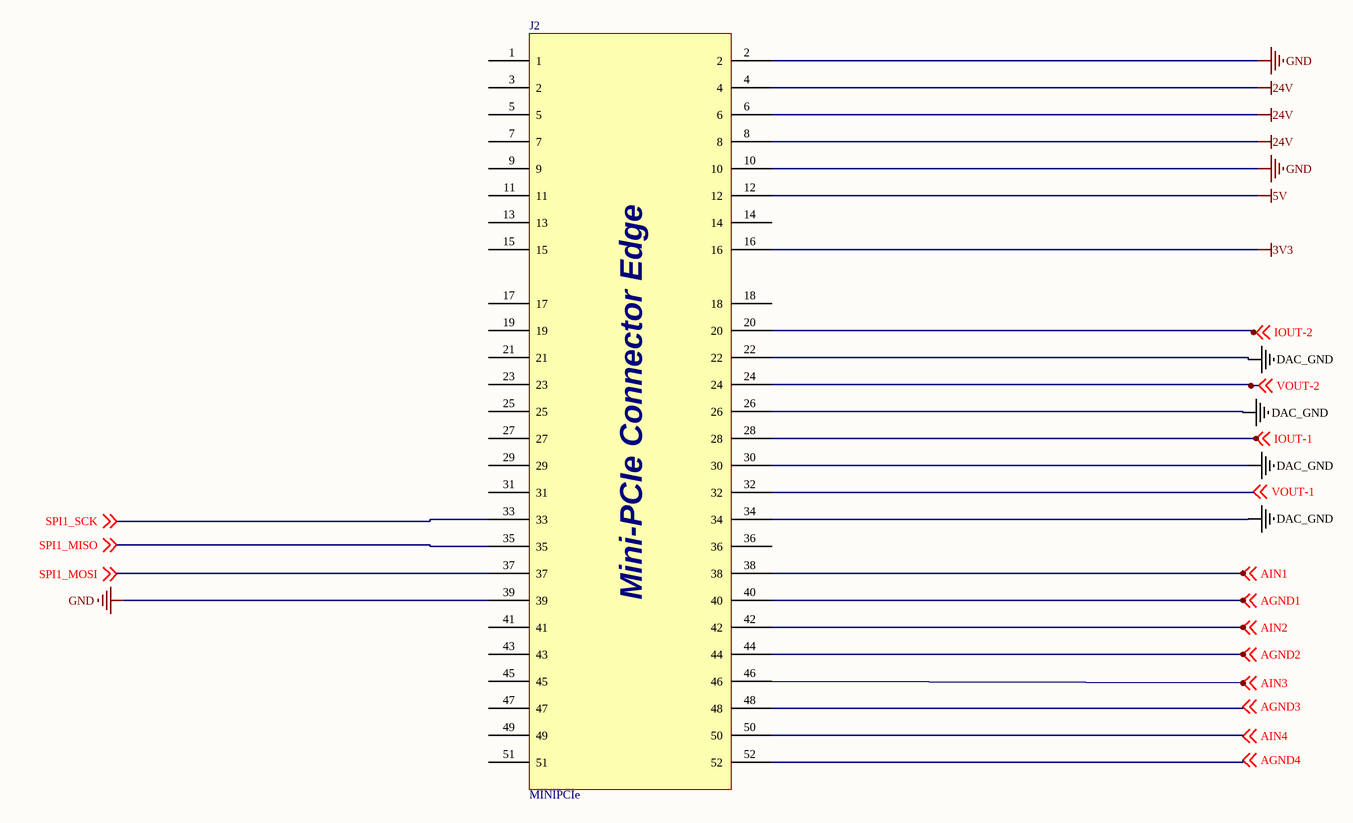
[diagram p3: [04] - miniPCI.SchDoc]

### Parts
J2  MINIPCIe  [MINI PCIe]

### Nets
3V3: J2.16
5V: J2.12
24V: J2.4 J2.6 J2.8
DAC_GND: J2.22 J2.26 J2.30 J2.34
GND: J2.2 J2.10 J2.39
AGND1: J2.40 ; off-sheet AGND1
AGND2: J2.44 ; off-sheet AGND2
AGND3: J2.48 ; off-sheet AGND3
AGND4: J2.52 ; off-sheet AGND4
AIN1: J2.38 ; off-sheet AIN1
AIN2: J2.42 ; off-sheet AIN2
AIN3: J2.46 ; off-sheet AIN3
AIN4: J2.50 ; off-sheet AIN4
IOUT-1: J2.28 ; off-sheet IOUT-1
IOUT-2: J2.20 ; off-sheet IOUT-2
SPI1_MISO: J2.35 ; off-sheet SPI1_MISO
SPI1_MOSI: J2.37 ; off-sheet SPI1_MOSI
SPI1_SCK: J2.33 ; off-sheet SPI1_SCK
VOUT-1: J2.32 ; off-sheet VOUT-1
VOUT-2: J2.24 ; off-sheet VOUT-2

Not connected (* = marked no-connect by the designer): J2 1 3(2) 5 7 9 11 13 14 15 17 18 19 21 23 25 27 29 31 36 41 43 45 47 49 51

### Notes on the sheet
- (in symbol MINIPCIe) Mini-PCIe Connector Edge

## Nets that join several sheets
3V3: [01] - STM32F101 (10 pins), [03] - DAC8760 (R5.2 R9.2), [04] - miniPCI (J2.16)
5V: [02] - AD7734 (8 pins), [03] - DAC8760 (U4.2 U5.2), [04] - miniPCI (J2.12)
24V: [03] - DAC8760 (C33.1 L13.1), [04] - miniPCI (J2.4 J2.6 J2.8)
DAC_GND: [03] - DAC8760 (37 pins), [04] - miniPCI (J2.22 J2.26 J2.30 J2.34)
GND: [01] - STM32F101 (15 pins), [02] - AD7734 (25 pins), [03] - DAC8760 (C33.2 U6.1), [04] - miniPCI (J2.2 J2.10 J2.39)
AGND1: [02] - AD7734 (L8.2), [04] - miniPCI (J2.40)
AGND2: [02] - AD7734 (L9.2), [04] - miniPCI (J2.44)
AGND3: [02] - AD7734 (L5.2), [04] - miniPCI (J2.48)
AGND4: [02] - AD7734 (L3.2), [04] - miniPCI (J2.52)
AIN1: [02] - AD7734 (L8.3), [04] - miniPCI (J2.38)
AIN2: [02] - AD7734 (L9.3), [04] - miniPCI (J2.42)
AIN3: [02] - AD7734 (L5.3), [04] - miniPCI (J2.46)
AIN4: [02] - AD7734 (L3.3), [04] - miniPCI (J2.50)
ALARM-1: [01] - STM32F101 (U1.33), [03] - DAC8760 (R5.1 U4.3)
ALARM-2: [01] - STM32F101 (U1.10), [03] - DAC8760 (R9.1 U5.3)
CLR-1: [01] - STM32F101 (U1.32), [03] - DAC8760 (U4.6)
CLR-2: [01] - STM32F101 (U1.11), [03] - DAC8760 (U5.6)
IOUT-1: [03] - DAC8760 (6 pins), [04] - miniPCI (J2.28)
IOUT-2: [03] - DAC8760 (6 pins), [04] - miniPCI (J2.20)
LATCH-1: [01] - STM32F101 (U1.31), [03] - DAC8760 (U4.7)
LATCH-2: [01] - STM32F101 (U1.12), [03] - DAC8760 (U5.7)
SPI1_MISO: [01] - STM32F101 (U1.40), [04] - miniPCI (J2.35)
SPI1_MOSI: [01] - STM32F101 (U1.41), [04] - miniPCI (J2.37)
SPI1_SCK: [01] - STM32F101 (U1.39), [04] - miniPCI (J2.33)
SPI2_MISO: [01] - STM32F101 (U1.27), [02] - AD7734 (U2.25), [03] - DAC8760 (U4.10 U5.10)
SPI2_MOSI: [01] - STM32F101 (U1.28), [02] - AD7734 (U2.26), [03] - DAC8760 (U4.9 U5.9)
SPI2_SCK: [01] - STM32F101 (U1.26), [02] - AD7734 (U2.1), [03] - DAC8760 (U4.8 U5.8)
VOUT-1: [03] - DAC8760 (7 pins), [04] - miniPCI (J2.32)
VOUT-2: [03] - DAC8760 (7 pins), [04] - miniPCI (J2.24)